# Altium schematic sheet cpu.SchDoc
size A3
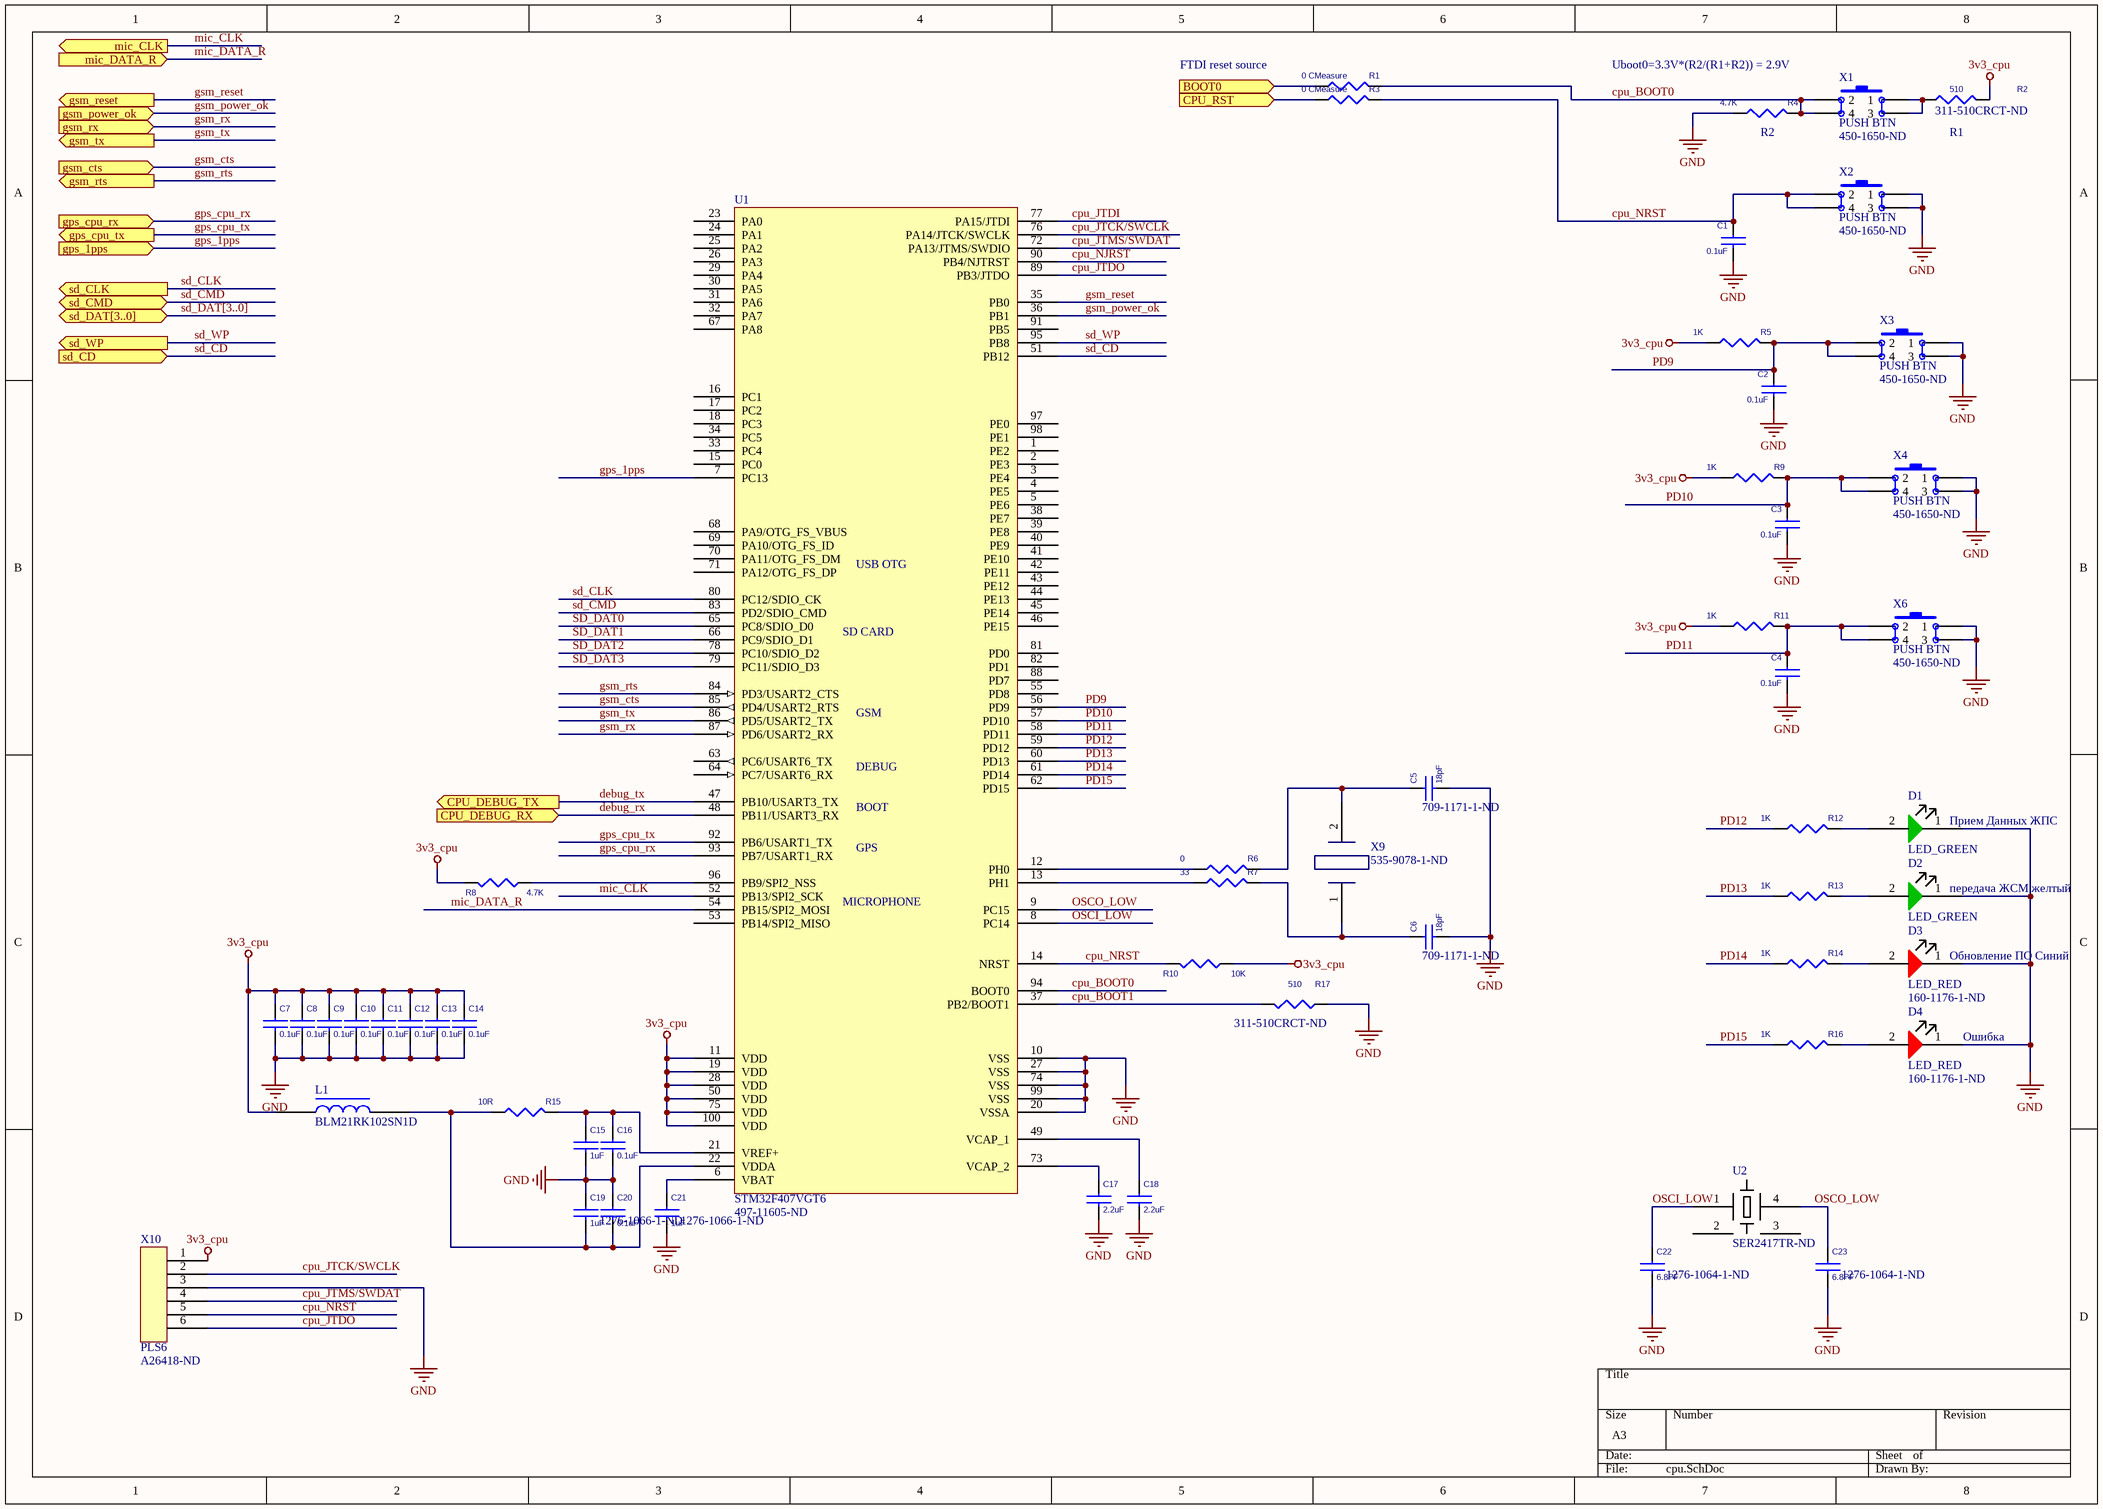
[diagram p0: cpu.SchDoc]

## Parts
C1  0.1uF  [CAPC2012X09M]
C2  0.1uF  [CAPC2012X09M]
C3  0.1uF  [CAPC2012X09M]
C4  0.1uF  [CAPC2012X09M]
C5  18pF  Supplier Part Number 1: 709-1171-1-ND  [CAPC2012X09M]
C6  18pF  Supplier Part Number 1: 709-1171-1-ND  [CAPC2012X09M]
C7  0.1uF  [CAPC2012X09M]
C8  0.1uF  [CAPC2012X09M]
C9  0.1uF  [CAPC2012X09M]
C10  0.1uF  [CAPC2012X09M]
C11  0.1uF  [CAPC2012X09M]
C12  0.1uF  [CAPC2012X09M]
C13  0.1uF  [CAPC2012X09M]
C14  0.1uF  [CAPC2012X09M]
C15  1uF  [CAPC2012X09M]
C16  0.1uF  [CAPC2012X09M]
C17  2.2uF  [CAPC2012X09M]
C18  2.2uF  [CAPC2012X09M]
C19  1uF  Supplier Part Number 1: 1276-1066-1-ND  [CAPC2012X09M]
C20  0.1uF  [CAPC2012X09M]
C21  1uF  Supplier Part Number 1: 1276-1066-1-ND  [CAPC2012X09M]
C22  6.8PF  Supplier Part Number 1: 1276-1064-1-ND  [CAPC2012X09M]
C23  6.8PF  Supplier Part Number 1: 1276-1064-1-ND  [CAPC2012X09M]
D1  LED_GREEN  [DIOC2012X11N]
D2  LED_GREEN  [DIOC2012X11N]
D3  LED_RED  Supplier Part Number 1: 160-1176-1-ND  [DIOC2012X11N]
D4  LED_RED  Supplier Part Number 1: 160-1176-1-ND  [DIOC2012X11N]
L1  BLM21RK102SN1D  [DIOC2012X11N]
R1  0 CMeasure  [RESC2013X06M_CMEASURE]
R2  510  Supplier Part Number 1: 311-510CRCT-ND  [RESC2013X06M]
R3  0 CMeasure  [RESC2013X06M_CMEASURE]
R4  4.7K  [RESC2013X06M]
R5  1K  [RESC2013X06M]
R6  0  [RESC2013X06M]
R7  33  [RESC2013X06M]
R8  4.7K  [RESC2013X06M]
R9  1K  [RESC2013X06M]
R10  10K  [RESC2013X06M]
R11  1K  [RESC2013X06M]
R12  1K  [RESC2013X06M]
R13  1K  [RESC2013X06M]
R14  1K  [RESC2013X06M]
R15  10R  [RESC2013X06M]
R16  1K  [RESC2013X06M]
R17  510  Supplier Part Number 1: 311-510CRCT-ND  [RESC2013X06M]
U1  STM32F407VGT6  Supplier Part Number 1: 497-11605-ND  [TSQFP50P1600X1600X160-100M]
U2  Supplier Part Number 1: SER2417TR-ND  [SOJ550P380X254-4M]  (hidden comment: 32.768KHZ)
X1  PUSH BTN  Supplier Part Number 1: 450-1650-ND  [PUSHBTN]
X2  PUSH BTN  Supplier Part Number 1: 450-1650-ND  [PUSHBTN]
X3  PUSH BTN  Supplier Part Number 1: 450-1650-ND  [PUSHBTN]
X4  PUSH BTN  Supplier Part Number 1: 450-1650-ND  [PUSHBTN]
X6  PUSH BTN  Supplier Part Number 1: 450-1650-ND  [PUSHBTN]
X9  Supplier Part Number 1: 535-9078-1-ND  [SODFL1270X420-2L]  (hidden comment: 25.000Mhz)
X10  PLS6  Supplier Part Number 1: A26418-ND  [PLS6]

## Ports
BOOT0 (in), CPU_DEBUG_RX (in), CPU_DEBUG_TX (out), CPU_RST (in), gps_1pps (in), gps_cpu_rx (in), gps_cpu_tx (out), gsm_cts (in), gsm_power_ok (in), gsm_reset (out), gsm_rts (out), gsm_rx (in), gsm_tx (out), mic_CLK (out), mic_DATA_R (in), sd_CD (in), sd_CLK (out), sd_CMD (bidir), sd_DAT[3..0] (bidir), sd_WP (out)

## Nets
3v3_cpu: C7.1 C8.1 C9.1 C10.1 C11.1 C12.1 C13.1 C14.1 L1.1 R2.1 R5.1 R8.2 R9.1 R10.1 R11.1 U1.11(VDD) U1.19(VDD) U1.28(VDD) U1.50(VDD) U1.75(VDD) U1.100(VDD) X10.1
GND: C1.2 C2.2 C3.2 C4.2 C5.2 C6.2 C7.2 C8.2 C9.2 C10.2 C11.2 C12.2 C13.2 C14.2 C15.2 C16.2 C17.2 C18.2 C19.1 C20.1 C21.2 C22.2 C23.2 D1.1(C) D2.1(C) D3.1(C) D4.1(C) R4.1 R17.1 U1.10(VSS) U1.20(VSSA) U1.27(VSS) U1.74(VSS) U1.99(VSS) X2.1 X2.3 X3.1 X3.3 X4.1 X4.3 X6.1 X6.3 X10.3
BOOT0: R1.1 ; port BOOT0
cpu_BOOT0: R1.2 R4.2 U1.94(BOOT0) X1.2 X1.4
cpu_BOOT1: R17.2 U1.37(PB2/BOOT1)
cpu_JTCK/SWCLK: U1.76(PA14/JTCK/SWCLK) X10.2
cpu_JTDI: U1.77(PA15/JTDI)
cpu_JTDO: U1.89(PB3/JTDO) X10.6
cpu_JTMS/SWDAT: U1.72(PA13/JTMS/SWDIO) X10.4
cpu_NJRST: U1.90(PB4/NJTRST)
cpu_NRST: C1.1 R3.2 R10.2 U1.14(NRST) X2.2 X2.4 X10.5
CPU_RST: R3.1 ; port CPU_RST
debug_rx: U1.48(PB11/USART3_RX) ; port CPU_DEBUG_RX
debug_tx: U1.47(PB10/USART3_TX) ; port CPU_DEBUG_TX
gps_1pps: U1.7(PC13) ; port gps_1pps
gps_cpu_rx: U1.93(PB7/USART1_RX) ; port gps_cpu_rx
gps_cpu_tx: U1.92(PB6/USART1_TX) ; port gps_cpu_tx
gsm_cts: U1.85(PD4/USART2_RTS) ; port gsm_cts
gsm_power_ok: U1.36(PB1) ; port gsm_power_ok
gsm_reset: U1.35(PB0) ; port gsm_reset
gsm_rts: U1.84(PD3/USART2_CTS) ; port gsm_rts
gsm_rx: U1.87(PD6/USART2_RX) ; port gsm_rx
gsm_tx: U1.86(PD5/USART2_TX) ; port gsm_tx
mic_CLK: U1.52(PB13/SPI2_SCK) ; port mic_CLK
mic_DATA_R: U1.54(PB15/SPI2_MOSI) ; port mic_DATA_R
OSCI_LOW: C22.1 U1.8(PC14) U2.1(OSC1)
OSCO_LOW: C23.1 U1.9(PC15) U2.4(OSC2)
PD9: C2.1 R5.2 U1.56(PD9) X3.2 X3.4
PD10: C3.1 R9.2 U1.57(PD10) X4.2 X4.4
PD11: C4.1 R11.2 U1.58(PD11) X6.2 X6.4
PD12: R12.1 U1.59(PD12)
PD13: R13.1 U1.60(PD13)
PD14: R14.1 U1.61(PD14)
PD15: R16.1 U1.62(PD15)
sd_CD: U1.51(PB12) ; port sd_CD
sd_CLK: U1.80(PC12/SDIO_CK) ; port sd_CLK
sd_CMD: U1.83(PD2/SDIO_CMD) ; port sd_CMD
SD_DAT0: U1.65(PC8/SDIO_D0)
SD_DAT1: U1.66(PC9/SDIO_D1)
SD_DAT2: U1.78(PC10/SDIO_D2)
SD_DAT3: U1.79(PC11/SDIO_D3)
sd_WP: U1.95(PB8) ; port sd_WP
NetC5_1: C5.1 R6.2 X9.2
NetC6_1: C6.1 R7.2 X9.1
NetC15_1: C15.1 C16.1 R15.2 U1.21(VREF+)
NetC17_1: C17.1 U1.73(VCAP_2)
NetC18_1: C18.1 U1.49(VCAP_1)
NetC19_2: C19.2 C20.2 L1.2 R15.1 U1.22(VDDA)
NetC21_1: C21.1 U1.6(VBAT)
NetD1_2: D1.2(A) R12.2
NetD2_2: D2.2(A) R13.2
NetD3_2: D3.2(A) R14.2
NetD4_2: D4.2(A) R16.2
NetR2_2: R2.2 X1.1 X1.3
NetR6_1: R6.1 U1.12(PH0)
NetR7_1: R7.1 U1.13(PH1)
NetR8_1: R8.1 U1.96(PB9/SPI2_NSS)

Not connected (* = marked no-connect by the designer): U1 1(PE2) 2(PE3) 3(PE4) 4(PE5) 5(PE6) 15(PC0) 16(PC1) 17(PC2) 18(PC3) 23(PA0) 24(PA1) 25(PA2) 26(PA3) 29(PA4) 30(PA5) 31(PA6) 32(PA7) 33(PC4) 34(PC5) 38(PE7) 39(PE8) 40(PE9) 41(PE10) 42(PE11) 43(PE12) 44(PE13) 45(PE14) 46(PE15) 53(PB14/SPI2_MISO) 55(PD8) 63(PC6/USART6_TX) 64(PC7/USART6_RX) 67(PA8) 68(PA9/OTG_FS_VBUS) 69(PA10/OTG_FS_ID) 70(PA11/OTG_FS_DM) 71(PA12/OTG_FS_DP) 81(PD0) 82(PD1) 88(PD7) 91(PB5) 97(PE0) 98(PE1); U2 2(NC) 3(NC)

## Buses and harness runs
bus sd_DAT[3..0] = port sd_DAT[3..0]

## Notes on the sheet
- FTDI reset source
- Uboot0=3.3V*(R2/(R1+R2)) = 2.9V
- (near R4) R2
- (near R2) R1
- (near D1) Прием Данных ЖПС
- (near D2) передача ЖСМ желтый
- (near D3) Обновление ПО Синий
- (near D4) Ошибка
- (in symbol STM32F407VGT6) USB OTG; SD CARD; GSM; DEBUG; BOOT; GPS; MICROPHONE

## Library data of the parts
C1-C4 C7-C14 C16 C20 = CAP_SMD_0.1UF_10%: CAP CER 0.1UF 25V 10% X7R 0805; Value: 0.1uF; Supplier 1: Digi-Key; Supplier Part Number 1: 399-1168-6-ND
C5 C6 = CAP_SMD_18PF_5%: CAP CER 27PF 200V 5% NP0 0805; Supplier 1: Digi-Key
C15 C19 C21 = CAP_SMD_1uF_10%: MLCC; 1uF; 25V; X7R; ±10%; SMD; 0805;; Value: 1uF; Supplier 1: Digi-Key
  C15: Supplier Part Number 1: 1276-1066-1-ND
C17 C18 = CAP_SMD_2.2uF_10%: CAP CER 2.2UF 16V 10% X5R 0805; Value: 2.2uF; Supplier 1: Digi-Key; Supplier Part Number 1: 587-1293-1-ND
C22 C23 = CAP_SMD_6.8PF_5%: CAP MLCC 6.8PF 50V 5% NP0 0805; Value: 6.8pF; Supplier 1: Digi-Key
R1 R3 = RES_SMD_0_CURRENT: RES 0.0 OHM 1/8W JUMP 0805 SMD; Supplier 1: Digi-Key; Supplier Part Number 1: P0.0ATR-ND
R2 R17 = RES_SMD_510_5%: RES - 510 OHM, 5%, 1/8W, 0805 SMD; Supplier 1: Digi-Key
R4 R8 = RES_SMD_4.7K_1%: RES 4.7K OHM 1/8W 1% 0805 SMD; Supplier 1: Digi-Key; Supplier Part Number 1: RMCF0805FT4K70CT-ND
R5 R9 R11-R14 R16 = RES_SMD_1K_5%: RES - 1K OHM, 5%, 1/8W, 0805 SMD; Supplier 1: Digi-Key; Supplier Part Number 1: P1.0KADKR-ND
R6 = RES_SMD_0: RES 0.0 OHM 1/8W JUMP 0805 SMD; Supplier 1: Digi-Key; Supplier Part Number 1: P0.0ATR-ND
R7 = RES_SMD_33R_5%: RES - 33 OHM, 5%, 1/8W, 0805 SMD; Supplier 1: Digi-Key; Supplier Part Number 1: 311-33ARCT-ND
R10 = RES_SMD_10K_5%: RES 10K OHM 1/8W 5% 0805 SMD; Supplier 1: Digi-Key; Supplier Part Number 1: 311-10KARCT-ND
R15 = RES_SMD_10R_5%: RES 10 OHM 1/8W 1% 0805 SMD; Supplier 1: Digi-Key; Supplier Part Number 1: P10.0CCT-ND
U2 = MC-306: Supplier 1: Digi-Key
X1-X4 X6 = SW1: Supplier 1: Digi-Key
X9 = OSC25M: Supplier 1: Digi-Key
D1 D2 = LED_GREEN: Supplier 1: Digi-Key; Supplier Part Number 1: 160-1179-2-ND
D3 D4 = LED_RED: Supplier 1: Digi-Key
L1 = BLM21RK102SN1D: Supplier 1: Digi-Key; Supplier Part Number 1: 490-9711-1-ND
U1 = STM32F407VGT6: Supplier 1: Digi-Key
X10 = PLS6: Supplier 1: Digi-Key